# Altium schematic sheet 53. SOC CPU HCPS-A.SchDoc: HCPS A - VDD CPU (part 1 of 2)
size 513 x 386 mm; Project: PROC154E2(001)_SK_AM69; Issue: 1.0; RevCode: E3; Page Create Date: March  8, 1995; Variant Name: Core Design; Schematic Page Number: 53; Page Number: 53; Page Size: C; Comment: MISTRAL_TITLEBLK_CSIZE_1; Page Count: 62; Schematic Page Count: 62; Name: PROC154E2 001 SK AM69; DsnPath: C:\Users\danie\Downloads\sprr466c\PROC154E3_RP\PROC154E3_SCH.DSN; SchematicName: SCHEMATIC1; PageName: 53. SOC CPU HCPS-A; PageSize: C; TopSchematic: True
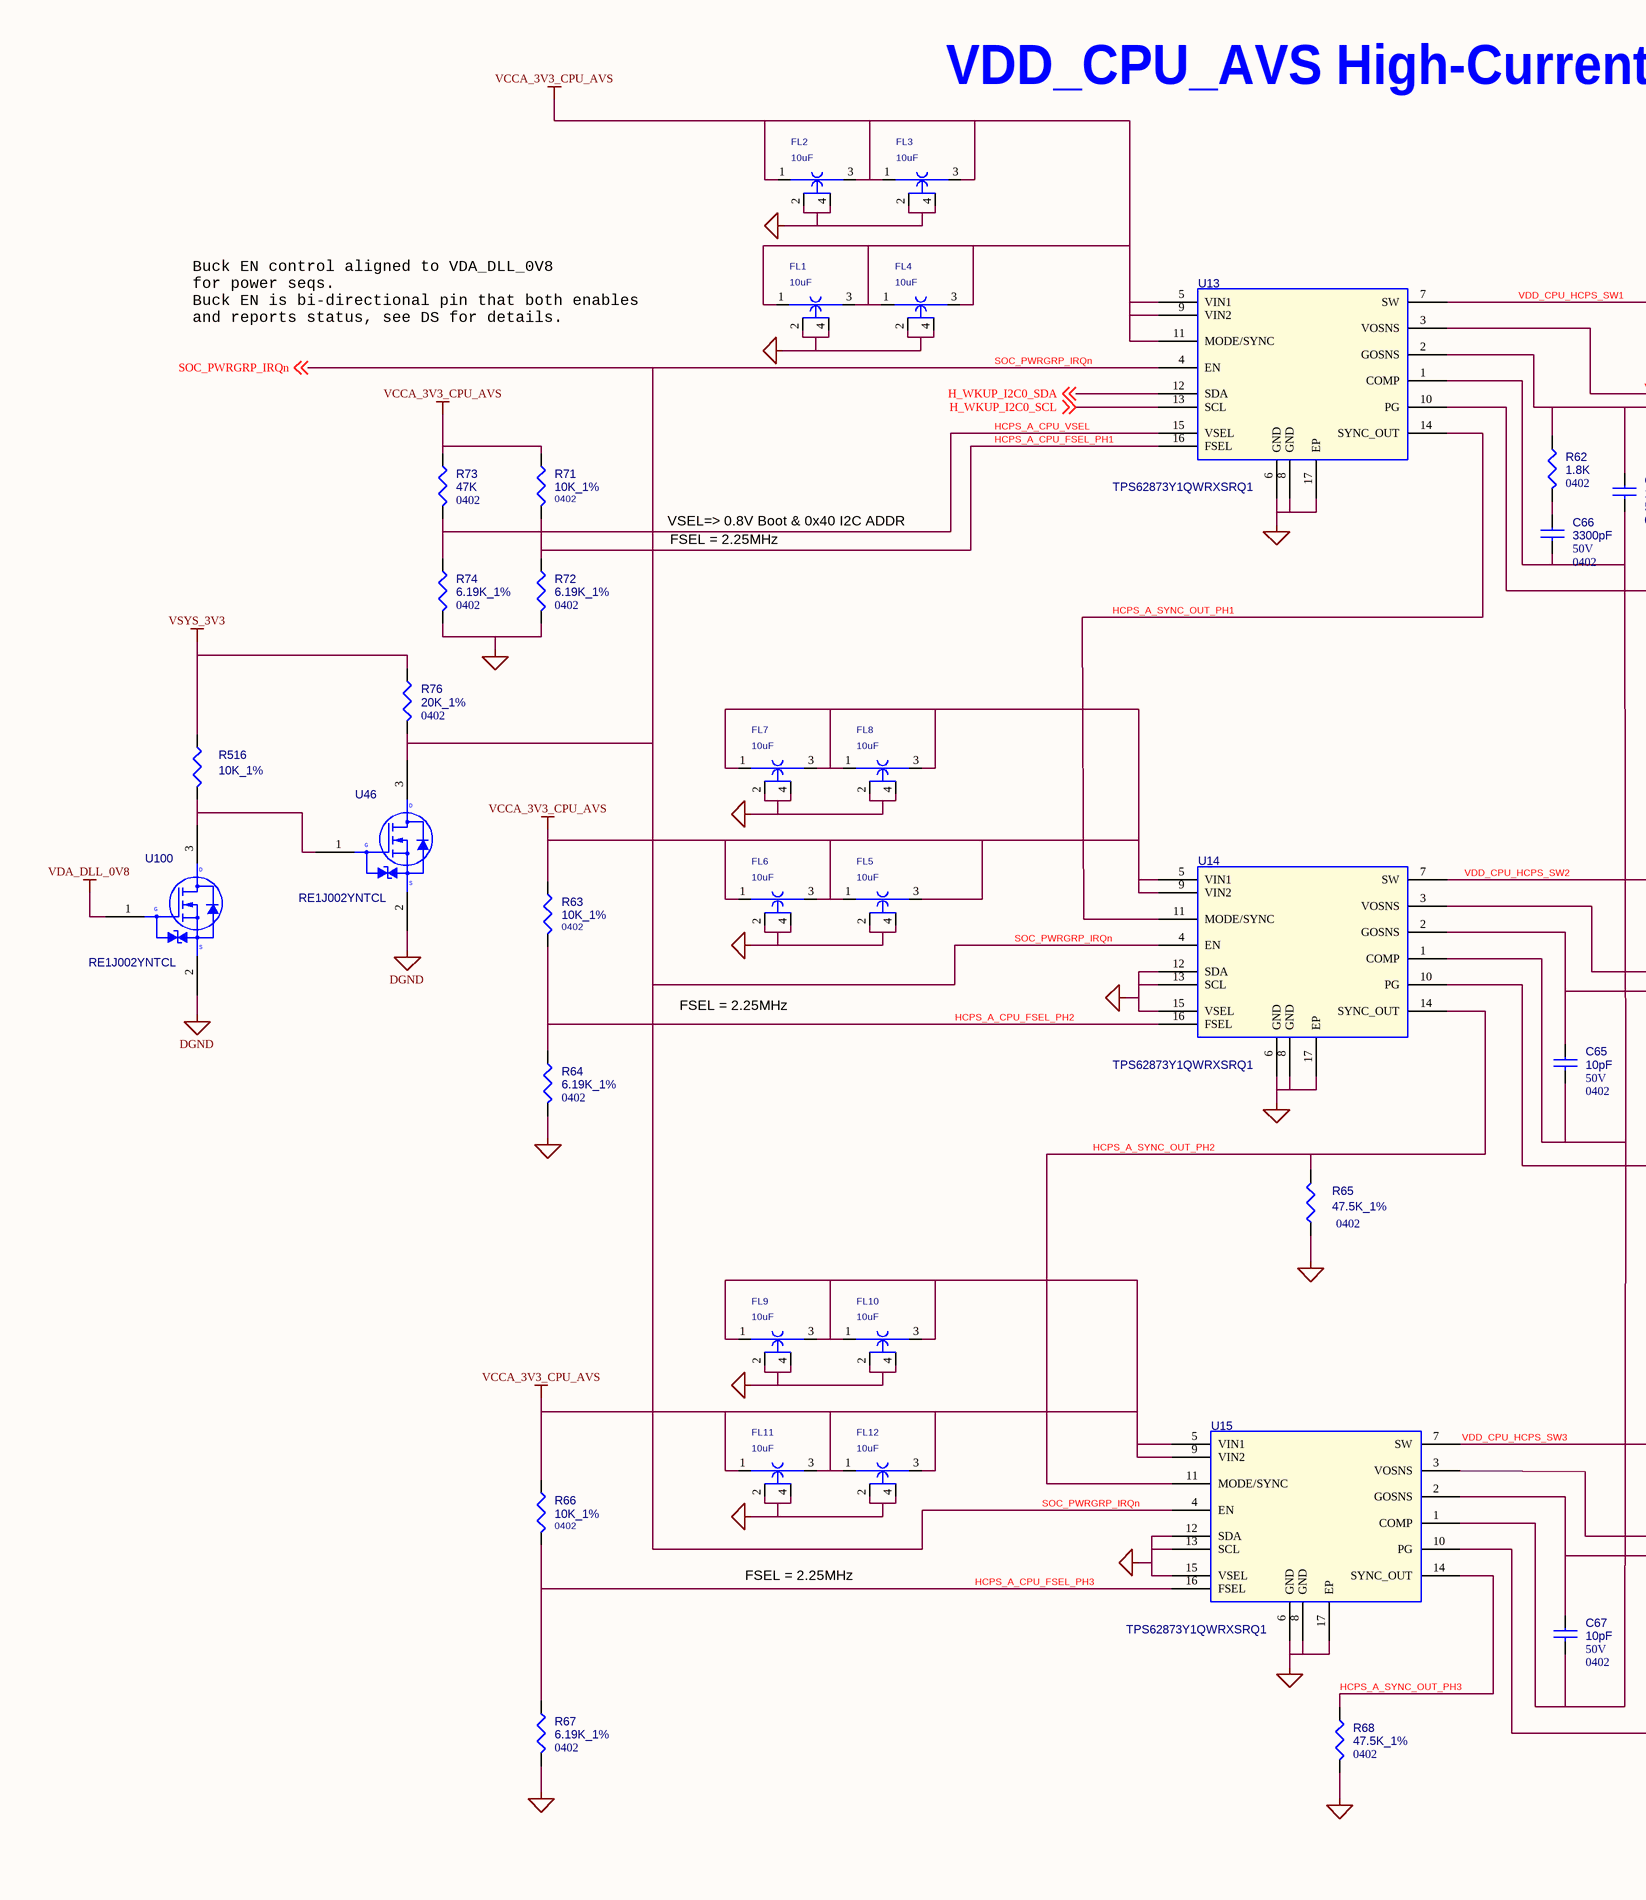
[diagram p0: 53. SOC CPU HCPS-A.SchDoc, left]
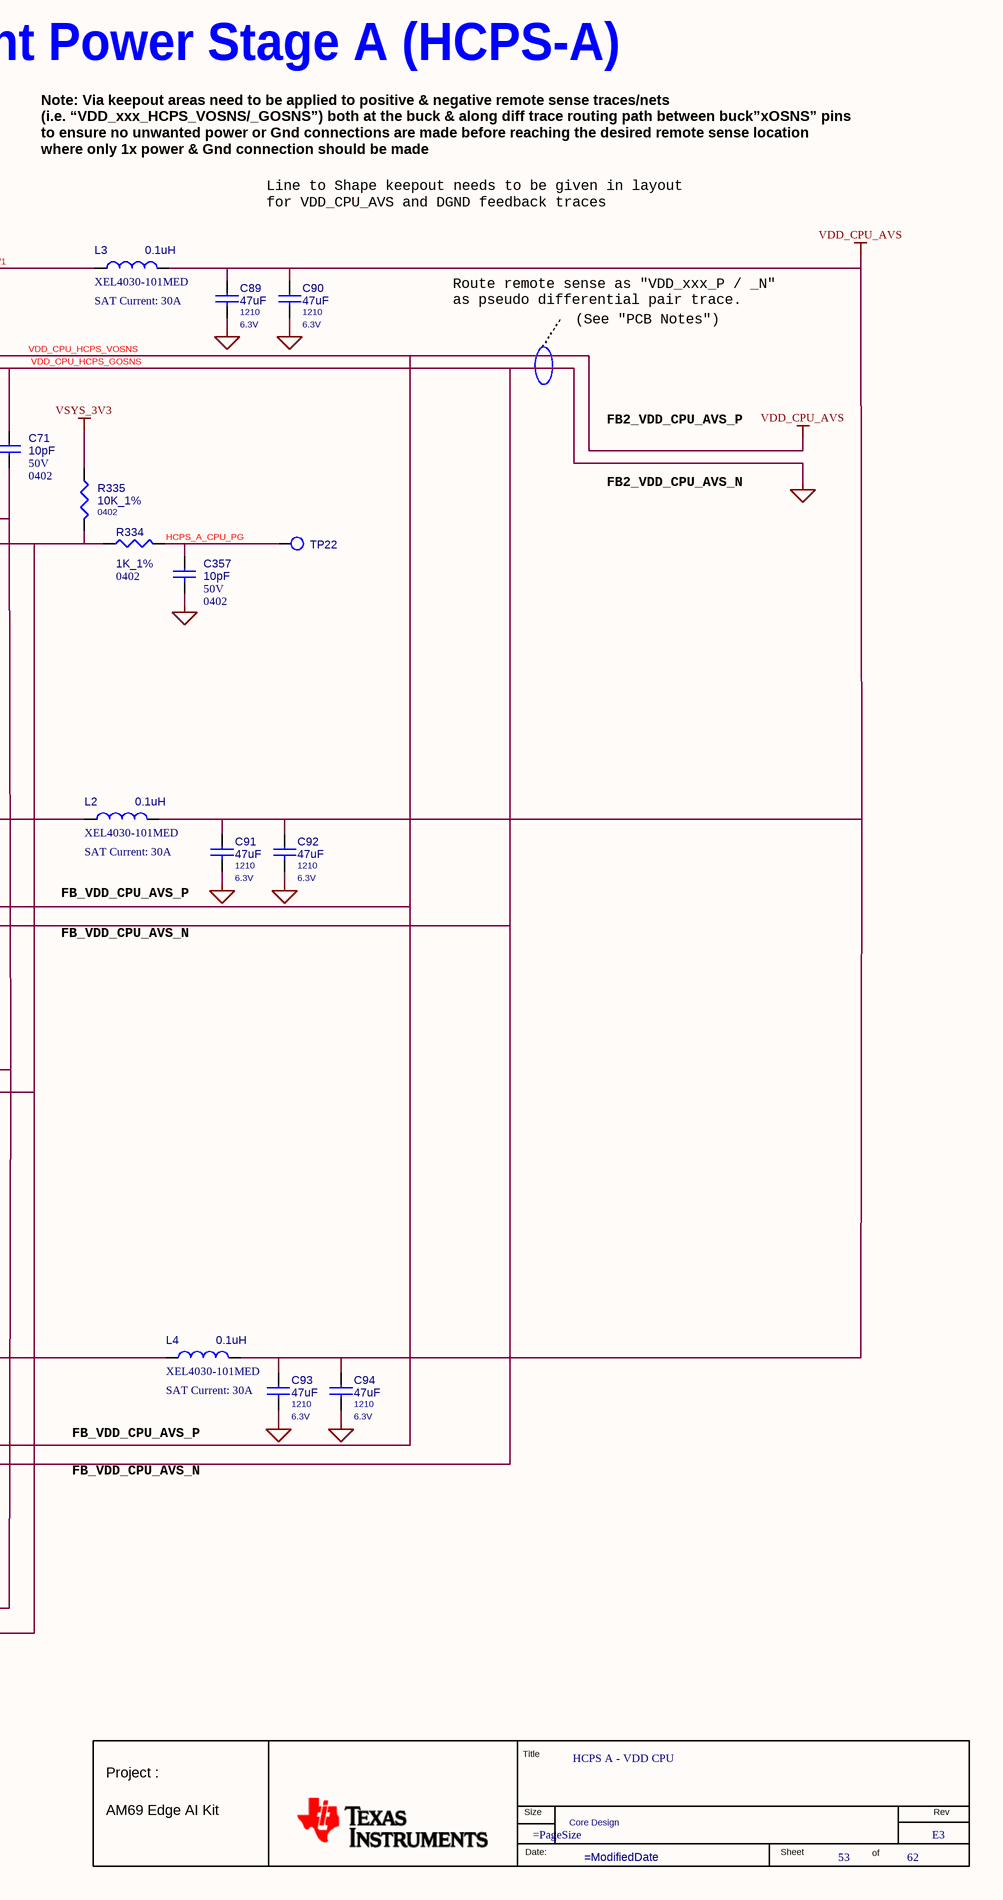
[diagram p1: 53. SOC CPU HCPS-A.SchDoc, right]

## Parts
*  RevCode: E3  Title: HCPS A - VDD CPU  Page Number: 53  Page Count: 62  Variant Name: Core Design  (hidden comment: MISTRAL_TITLEBLK_CSIZE_1)  (graphical)
C65  10pF  Package: 0402  Voltage: 50V  [CAP0402_0-75]
C66  3300pF  Package: 0402  Voltage: 50V  [CAP0402_0-75]
C67  10pF  Voltage: 50V  Package: 0402  [CAP0402_0-75]
C71  10pF  Voltage: 50V  Package: 0402  [CAP0402_0-75]
C89  47uF  Package: 1210  Voltage: 6.3V  [CAP1210_2-75]
C90  47uF  Package: 1210  Voltage: 6.3V  [CAP1210_2-75]
C91  47uF  Package: 1210  Voltage: 6.3V  [CAP1210_2-75]
C92  47uF  Package: 1210  Voltage: 6.3V  [CAP1210_2-75]
C93  47uF  Voltage: 6.3V  Package: 1210  [CAP1210_2-75]
C94  47uF  Voltage: 6.3V  Package: 1210  [CAP1210_2-75]
C357  10pF  Package: 0402  Voltage: 50V  [CAP0402_0-75]
FL1  10uF  [EMIFIL_NFM18C_0603_0-7_TI]
FL2  10uF  [EMIFIL_NFM18C_0603_0-7_TI]
FL3  10uF  [EMIFIL_NFM18C_0603_0-7_TI]
FL4  10uF  [EMIFIL_NFM18C_0603_0-7_TI]
FL5  10uF  [EMIFIL_NFM18C_0603_0-7_TI]
FL6  10uF  [EMIFIL_NFM18C_0603_0-7_TI]
FL7  10uF  [EMIFIL_NFM18C_0603_0-7_TI]
FL8  10uF  [EMIFIL_NFM18C_0603_0-7_TI]
FL9  10uF  [EMIFIL_NFM18C_0603_0-7_TI]
FL10  10uF  [EMIFIL_NFM18C_0603_0-7_TI]
FL11  10uF  [EMIFIL_NFM18C_0603_0-7_TI]
FL12  10uF  [EMIFIL_NFM18C_0603_0-7_TI]
L2  0.1uH  Mfr_part_number: XEL4030-101MED  SAT Current: 30A  [IND_XEL4030_170X170_SMD_3-2]
L3  0.1uH  Mfr_part_number: XEL4030-101MED  SAT Current: 30A  [IND_XEL4030_170X170_SMD_3-2]
L4  0.1uH  SAT Current: 30A  Mfr_part_number: XEL4030-101MED  [IND_XEL4030_170X170_SMD_3-2]
R62  1.8K  Package: 0402  [RES0402_0-5]
R63  10K_1%  Package: 0402  [RES0402_0-5]
R64  6.19K_1%  Package: 0402  [RES0402_0-5]
R65  47.5K_1%  Package: 0402  [RES0402_0-5]
R66  10K_1%  Package: 0402  [RES0402_0-5]
R67  6.19K_1%  Package: 0402  [RES0402_0-5]
R68  47.5K_1%  Package: 0402  [RES0402_0-5]
R71  10K_1%  Package: 0402  [RES0402_0-5]
R72  6.19K_1%  Package: 0402  [RES0402_0-5]
R73  47K  Package: 0402  [RES0402_0-5]
R74  6.19K_1%  Package: 0402  [RES0402_0-5]
R76  20K_1%  Package: 0402  [RES0402_0-5]
R334  1K_1%  Package: 0402  [RES0402_0-5]
R335  10K_1%  Package: 0402  [RES0402_0-5]
R516  10K_1%  [RES0402_0-5]
TP22  TP30_SMD  [TP30_SMD]  (value not drawn)
U13  TPS62873Y1QWRXSRQ1  [VQFN16_TPS62872-Q1_100X140_1-1]
U14  TPS62873Y1QWRXSRQ1  [VQFN16_TPS62872-Q1_100X140_1-1]
U15  TPS62873Y1QWRXSRQ1  [VQFN16_TPS62872-Q1_100X140_1-1]
U46  RE1J002YNTCL  [SOT416F-6_0-9]
U100  RE1J002YNTCL  [SOT416F-6_0-9]

## Nets
VCCA_3V3_CPU_AVS: FL1.1 FL1.3 FL2.1 FL2.3 FL3.1 FL3.3 FL4.1 FL4.3 FL5.1 FL5.3 FL6.1 FL6.3 FL7.1 FL7.3 FL8.1 FL8.3 FL9.1 FL9.3 FL10.1 FL10.3 FL11.1 FL11.3 FL12.1 FL12.3 R63.1 R66.1 R71.1 R73.1 U13.5(VIN1) U13.9(VIN2) U13.11(MODE/SYNC) U14.5(VIN1) U14.9(VIN2) U15.5(VIN1) U15.9(VIN2)
VDA_DLL_0V8: U100.1(G)
VDD_CPU_HCPS_GOSNS: C65.1 C67.1 C71.1 C89.2 C90.2 C91.2 C92.2 C93.2 C94.2 C357.2 FL1.2 FL1.4 FL2.2 FL2.4 FL3.2 FL3.4 FL4.2 FL4.4 FL5.2 FL5.4 FL6.2 FL6.4 FL7.2 FL7.4 FL8.2 FL8.4 FL9.2 FL9.4 FL10.2 FL10.4 FL11.2 FL11.4 FL12.2 FL12.4 R62.1 R64.2 R65.2 R67.2 R68.2 R72.2 R74.2 U13.2(GOSNS) U13.6(GND) U13.8(GND) U13.17(EP) U14.2(GOSNS) U14.6(GND) U14.8(GND) U14.12(SDA) U14.13(SCL) U14.15(VSEL) U14.17(EP) U15.2(GOSNS) U15.6(GND) U15.8(GND) U15.12(SDA) U15.13(SCL) U15.15(VSEL) U15.17(EP) U46.2(S) U100.2(S)  [also labelled DGND]
VDD_CPU_HCPS_VOSNS: C89.1 C90.1 C91.1 C92.1 C93.1 C94.1 L2.2 L3.2 L4.2 U13.3(VOSNS) U14.3(VOSNS) U15.3(VOSNS)  [also labelled VDD_CPU_AVS]
VSYS_3V3: R76.1 R335.1 R516.1
H_WKUP_I2C0_SCL: U13.13(SCL) ; off-sheet H_WKUP_I2C0_SCL
H_WKUP_I2C0_SDA: U13.12(SDA) ; off-sheet H_WKUP_I2C0_SDA
HCPS_A_CPU_FSEL_PH1: R71.2 R72.1 U13.16(FSEL)
HCPS_A_CPU_FSEL_PH2: R63.2 R64.1 U14.16(FSEL)
HCPS_A_CPU_FSEL_PH3: R66.2 R67.1 U15.16(FSEL)
HCPS_A_CPU_PG: C357.1 R334.2 TP22.1(TP)
HCPS_A_CPU_VSEL: R73.2 R74.1 U13.15(VSEL)
HCPS_A_SYNC_OUT_PH1: U13.14(SYNC_OUT) U14.11(MODE/SYNC)
HCPS_A_SYNC_OUT_PH2: R65.1 U14.14(SYNC_OUT) U15.11(MODE/SYNC)
HCPS_A_SYNC_OUT_PH3: R68.1 U15.14(SYNC_OUT)
SOC_PWRGRP_IRQn: R76.2 U13.4(EN) U14.4(EN) U15.4(EN) U46.3(D) ; off-sheet SOC_PWRGRP_IRQn
VDD_CPU_HCPS_SW1: L3.1 U13.7(SW)
VDD_CPU_HCPS_SW2: L2.1 U14.7(SW)
VDD_CPU_HCPS_SW3: L4.1 U15.7(SW)
NetC65_2: C65.2 C66.2 C67.2 C71.2 U13.1(COMP) U14.1(COMP) U15.1(COMP)
NetC66_1: C66.1 R62.2
NetR334_1: R334.1 R335.2 U13.10(PG) U14.10(PG) U15.10(PG)
NetR516_2: R516.2 U46.1(G) U100.3(D)

## Notes on the sheet
- VDD_CPU_AVS High-Current Power Stage A (HCPS-A)
- Note: Via keepout areas need to be applied to positive & negative remote sense traces/nets
  (i.e. “VDD_xxx_HCPS_VOSNS/_GOSNS”) both at the buck & along diff trace routing path between buck”xOSNS” pins
  to ensure no unwanted power or Gnd connections are made before reaching the desired remote sense location
  where only 1x power & Gnd connection should be made
- Line to Shape keepout needs to be given in layout
  for VDD_CPU_AVS and DGND feedback traces
- Buck EN control aligned to VDA_DLL_0V8
  for power seqs.
  Buck EN is bi-directional pin that both enables
  and reports status, see DS for details.
- Route remote sense as "VDD_xxx_P / _N"
  as pseudo differential pair trace.
- (See "PCB Notes")
- FB2_VDD_CPU_AVS_P
- VSEL=> 0.8V Boot & 0x40 I2C ADDR
- FSEL = 2.25MHz
- FB2_VDD_CPU_AVS_N
- FB_VDD_CPU_AVS_P
- FB_VDD_CPU_AVS_N
- (in symbol MISTRAL_TITLEBLK_CSIZE_1) Title; Project :; Size; Rev; AM69 Edge AI Kit; Date:; Sheet; of